# Altium schematic sheet B2B.schdoc: TEBF0808 - B2B-connectors
size A4; DocumentNumber: TEBF0808; Revision: 04; SheetNumber: 2; SheetTotal: 36; Date: 2016-09-29; CompanyName: Trenz Electronic GmbH; Organization: Trenz Electronic GmbH
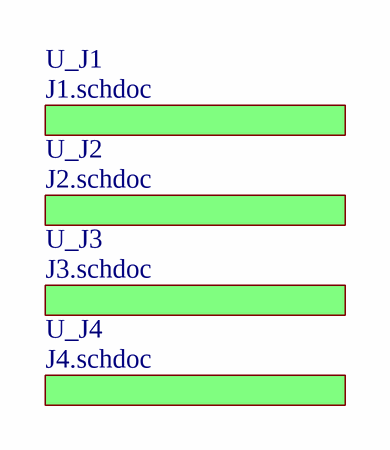
[diagram p0: B2B.schdoc]

## Sub-sheets
U_J1 = J1.schdoc: no entries
U_J2 = J2.schdoc: no entries
U_J3 = J3.schdoc: no entries
U_J4 = J4.schdoc: no entries

## Notes on the sheet
- Title:
- Number:
- Rev.
- Date:
- A4
- Copyright:
- Page
- of
- Filename: